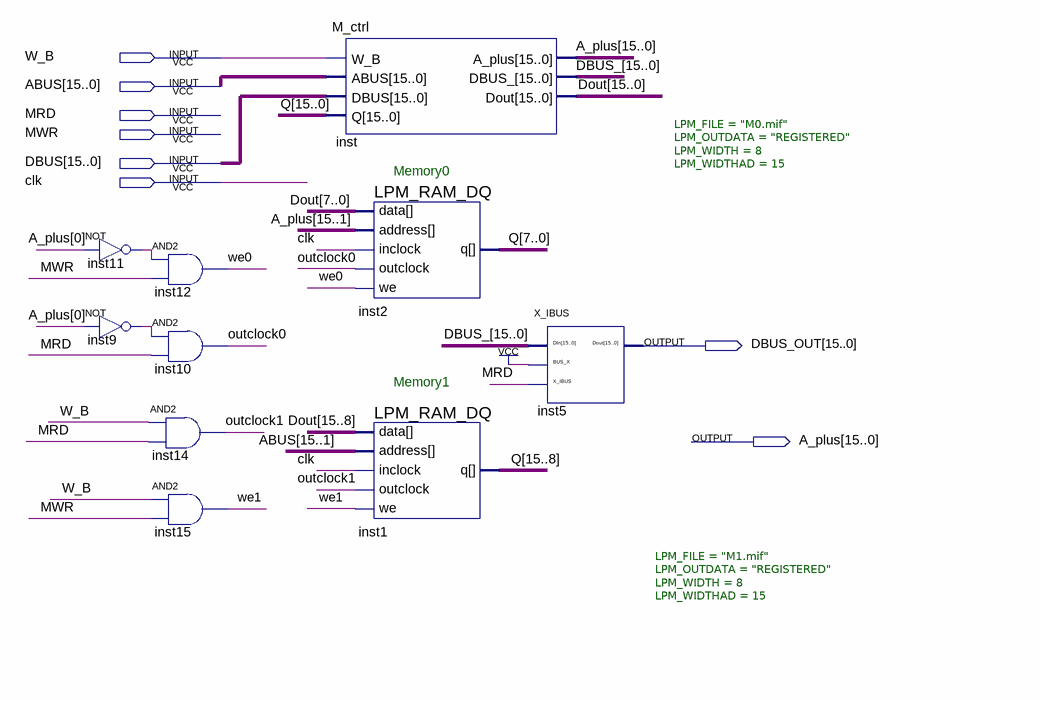
[diagram p0: schematic sheet]
// Quartus schematic Memory.bdf as structural Verilog: 10 symbols, 8 pins
module Memory (
  input  W_B,
  input  [15:0] ABUS,
  input  MRD,
  input  MWR,
  input  [15:0] DBUS,
  input  clk,
  output [15:0] DBUS_OUT,
  output [15:0] A_plus
);

  wire inst9_out, inst11_out, outclock0, outclock1, we0, we1;
  wire [15:0] DBUS_, Dout, Q;

  not inst11 (inst11_out, A_plus[0]);
  not inst9 (inst9_out, A_plus[0]);
  and inst12 (we0, inst11_out, MWR);
  and inst10 (outclock0, inst9_out, MRD);
  and inst14 (outclock1, W_B, MRD);
  and inst15 (we1, W_B, MWR);
  M_ctrl inst (.W_B(W_B), .ABUS(ABUS), .DBUS(DBUS), .Q(Q), .A_plus(A_plus), .DBUS_(DBUS_), .Dout(Dout));
  LPM_RAM_DQ #(.LPM_FILE("M0.mif"), .LPM_OUTDATA("REGISTERED"), .LPM_WIDTH(8), .LPM_WIDTHAD(15)) inst2 (
    .inclock(clk), .data(Dout[7:0]), .address(A_plus[15:1]), .we(we0), .outclock(outclock0), .q(Q[7:0]));
  LPM_RAM_DQ #(.LPM_FILE("M1.mif"), .LPM_OUTDATA("REGISTERED"), .LPM_WIDTH(8), .LPM_WIDTHAD(15)) inst1 (
    .inclock(clk), .data(Dout[15:8]), .address(ABUS[15:1]), .we(we1), .outclock(outclock1), .q(Q[15:8]));
  X_IBUS inst5 (.DIn(DBUS_), .BUS_X(1'b1), .X_IBUS(MRD), .Dout(DBUS_OUT));

  // Notes on the sheet:
  //   Memory0
  //   Memory1
endmodule
